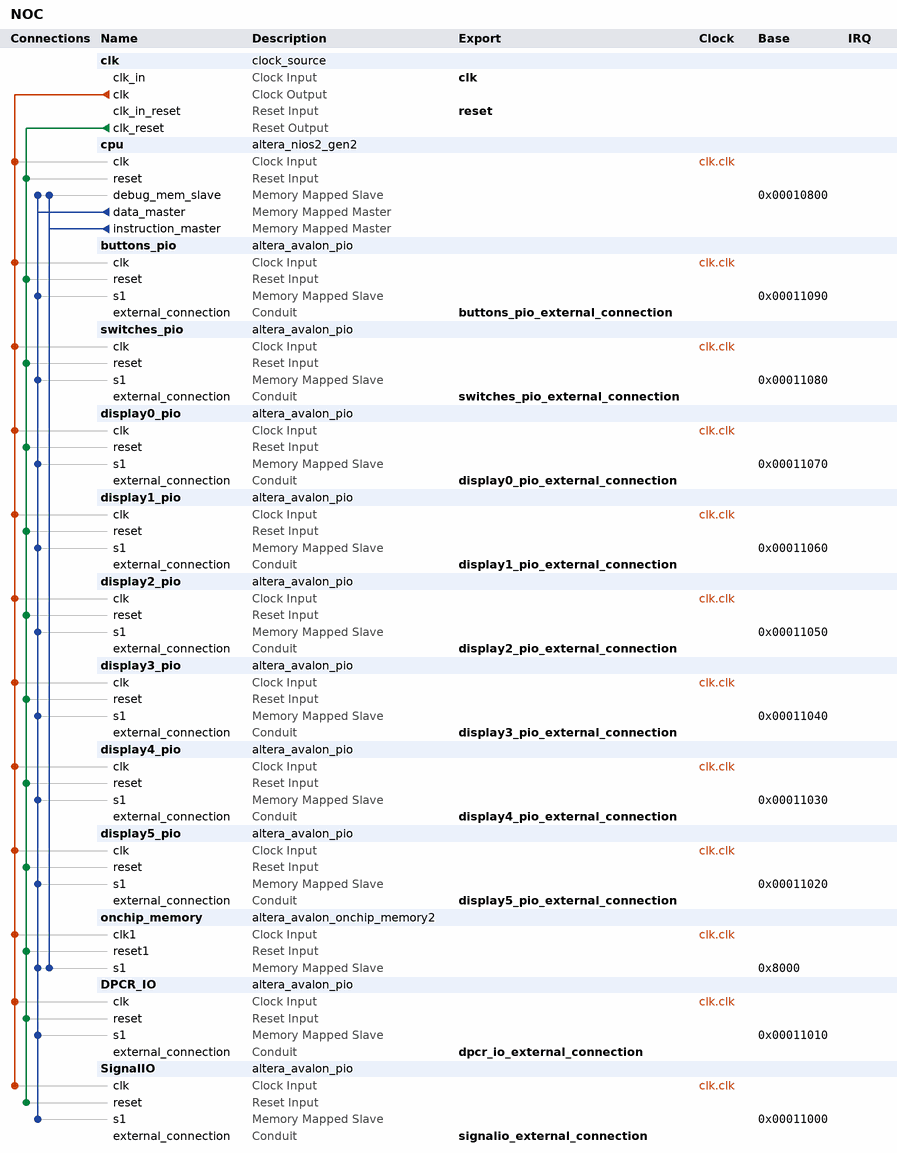
[diagram p0: system contents]
# Platform Designer (Qsys) system NOC, Cyclone V 5CSEMA5F31C6
# Parameters at their usual value, and those the tool derives, are not listed.
package require -exact qsys 18.1
create_system NOC
set_project_property DEVICE_FAMILY {Cyclone V}
set_project_property DEVICE 5CSEMA5F31C6

add_instance clk clock_source 18.1
set_instance_parameter_value clk clockFrequency 50000000

add_instance cpu altera_nios2_gen2 18.1
set_instance_parameter_value cpu cpuID 1
set_instance_parameter_value cpu dcache_size 2048
set_instance_parameter_value cpu exceptionSlave onchip_memory.s1
set_instance_parameter_value cpu icache_size 4096
set_instance_parameter_value cpu impl Fast
set_instance_parameter_value cpu resetSlave onchip_memory.s1

add_instance buttons_pio altera_avalon_pio 18.1
set_instance_parameter_value buttons_pio direction InOut
set_instance_parameter_value buttons_pio width 4

add_instance switches_pio altera_avalon_pio 18.1
set_instance_parameter_value switches_pio direction InOut
set_instance_parameter_value switches_pio width 10

add_instance display0_pio altera_avalon_pio 18.1
set_instance_parameter_value display0_pio direction InOut
set_instance_parameter_value display0_pio width 7

add_instance display1_pio altera_avalon_pio 18.1
set_instance_parameter_value display1_pio direction InOut
set_instance_parameter_value display1_pio width 7

add_instance display2_pio altera_avalon_pio 18.1
set_instance_parameter_value display2_pio direction InOut
set_instance_parameter_value display2_pio width 7

add_instance display3_pio altera_avalon_pio 18.1
set_instance_parameter_value display3_pio direction InOut
set_instance_parameter_value display3_pio width 7

add_instance display4_pio altera_avalon_pio 18.1
set_instance_parameter_value display4_pio direction InOut
set_instance_parameter_value display4_pio width 7

add_instance display5_pio altera_avalon_pio 18.1
set_instance_parameter_value display5_pio direction InOut
set_instance_parameter_value display5_pio width 7

add_instance onchip_memory altera_avalon_onchip_memory2 18.1
set_instance_parameter_value onchip_memory dataWidth 32
set_instance_parameter_value onchip_memory dualPort false
set_instance_parameter_value onchip_memory initMemContent true
set_instance_parameter_value onchip_memory initializationFileName onchip_mem.hex
set_instance_parameter_value onchip_memory memorySize 20480

add_instance DPCR_IO altera_avalon_pio 18.1
set_instance_parameter_value DPCR_IO direction InOut
set_instance_parameter_value DPCR_IO width 32

add_instance SignalIO altera_avalon_pio 18.1
set_instance_parameter_value SignalIO direction InOut
set_instance_parameter_value SignalIO width 10

# connections
add_connection clk.clk buttons_pio.clk clock
add_connection clk.clk cpu.clk clock
add_connection clk.clk display0_pio.clk clock
add_connection clk.clk display1_pio.clk clock
add_connection clk.clk display2_pio.clk clock
add_connection clk.clk display3_pio.clk clock
add_connection clk.clk display4_pio.clk clock
add_connection clk.clk display5_pio.clk clock
add_connection clk.clk DPCR_IO.clk clock
add_connection clk.clk onchip_memory.clk1 clock
add_connection clk.clk SignalIO.clk clock
add_connection clk.clk switches_pio.clk clock
add_connection clk.clk_reset buttons_pio.reset reset
add_connection clk.clk_reset cpu.reset reset
add_connection clk.clk_reset display0_pio.reset reset
add_connection clk.clk_reset display1_pio.reset reset
add_connection clk.clk_reset display2_pio.reset reset
add_connection clk.clk_reset display3_pio.reset reset
add_connection clk.clk_reset display4_pio.reset reset
add_connection clk.clk_reset display5_pio.reset reset
add_connection clk.clk_reset DPCR_IO.reset reset
add_connection clk.clk_reset onchip_memory.reset1 reset
add_connection clk.clk_reset SignalIO.reset reset
add_connection clk.clk_reset switches_pio.reset reset
add_connection cpu.data_master buttons_pio.s1 avalon
set_connection_parameter_value cpu.data_master/buttons_pio.s1 baseAddress 0x00011090
add_connection cpu.data_master cpu.debug_mem_slave avalon
set_connection_parameter_value cpu.data_master/cpu.debug_mem_slave baseAddress 0x00010800
add_connection cpu.data_master display0_pio.s1 avalon
set_connection_parameter_value cpu.data_master/display0_pio.s1 baseAddress 0x00011070
add_connection cpu.data_master display1_pio.s1 avalon
set_connection_parameter_value cpu.data_master/display1_pio.s1 baseAddress 0x00011060
add_connection cpu.data_master display2_pio.s1 avalon
set_connection_parameter_value cpu.data_master/display2_pio.s1 baseAddress 0x00011050
add_connection cpu.data_master display3_pio.s1 avalon
set_connection_parameter_value cpu.data_master/display3_pio.s1 baseAddress 0x00011040
add_connection cpu.data_master display4_pio.s1 avalon
set_connection_parameter_value cpu.data_master/display4_pio.s1 baseAddress 0x00011030
add_connection cpu.data_master display5_pio.s1 avalon
set_connection_parameter_value cpu.data_master/display5_pio.s1 baseAddress 0x00011020
add_connection cpu.data_master DPCR_IO.s1 avalon
set_connection_parameter_value cpu.data_master/DPCR_IO.s1 baseAddress 0x00011010
add_connection cpu.data_master onchip_memory.s1 avalon
set_connection_parameter_value cpu.data_master/onchip_memory.s1 baseAddress 0x8000
add_connection cpu.data_master SignalIO.s1 avalon
set_connection_parameter_value cpu.data_master/SignalIO.s1 baseAddress 0x00011000
add_connection cpu.data_master switches_pio.s1 avalon
set_connection_parameter_value cpu.data_master/switches_pio.s1 baseAddress 0x00011080
add_connection cpu.instruction_master cpu.debug_mem_slave avalon
set_connection_parameter_value cpu.instruction_master/cpu.debug_mem_slave baseAddress 0x00010800
add_connection cpu.instruction_master onchip_memory.s1 avalon
set_connection_parameter_value cpu.instruction_master/onchip_memory.s1 baseAddress 0x8000

# exported interfaces
add_interface buttons_pio_external_connection conduit end
set_interface_property buttons_pio_external_connection EXPORT_OF buttons_pio.external_connection
add_interface clk clock sink
set_interface_property clk EXPORT_OF clk.clk_in
add_interface display0_pio_external_connection conduit end
set_interface_property display0_pio_external_connection EXPORT_OF display0_pio.external_connection
add_interface display1_pio_external_connection conduit end
set_interface_property display1_pio_external_connection EXPORT_OF display1_pio.external_connection
add_interface display2_pio_external_connection conduit end
set_interface_property display2_pio_external_connection EXPORT_OF display2_pio.external_connection
add_interface display3_pio_external_connection conduit end
set_interface_property display3_pio_external_connection EXPORT_OF display3_pio.external_connection
add_interface display4_pio_external_connection conduit end
set_interface_property display4_pio_external_connection EXPORT_OF display4_pio.external_connection
add_interface display5_pio_external_connection conduit end
set_interface_property display5_pio_external_connection EXPORT_OF display5_pio.external_connection
add_interface dpcr_io_external_connection conduit end
set_interface_property dpcr_io_external_connection EXPORT_OF DPCR_IO.external_connection
add_interface reset reset sink
set_interface_property reset EXPORT_OF clk.clk_in_reset
add_interface signalio_external_connection conduit end
set_interface_property signalio_external_connection EXPORT_OF SignalIO.external_connection
add_interface switches_pio_external_connection conduit end
set_interface_property switches_pio_external_connection EXPORT_OF switches_pio.external_connection

set_interconnect_requirement {$system} qsys_mm.clockCrossingAdapter HANDSHAKE
set_interconnect_requirement {$system} qsys_mm.enableEccProtection FALSE
set_interconnect_requirement {$system} qsys_mm.insertDefaultSlave FALSE
set_interconnect_requirement {$system} qsys_mm.maxAdditionalLatency 1

save_system NOC.qsys
